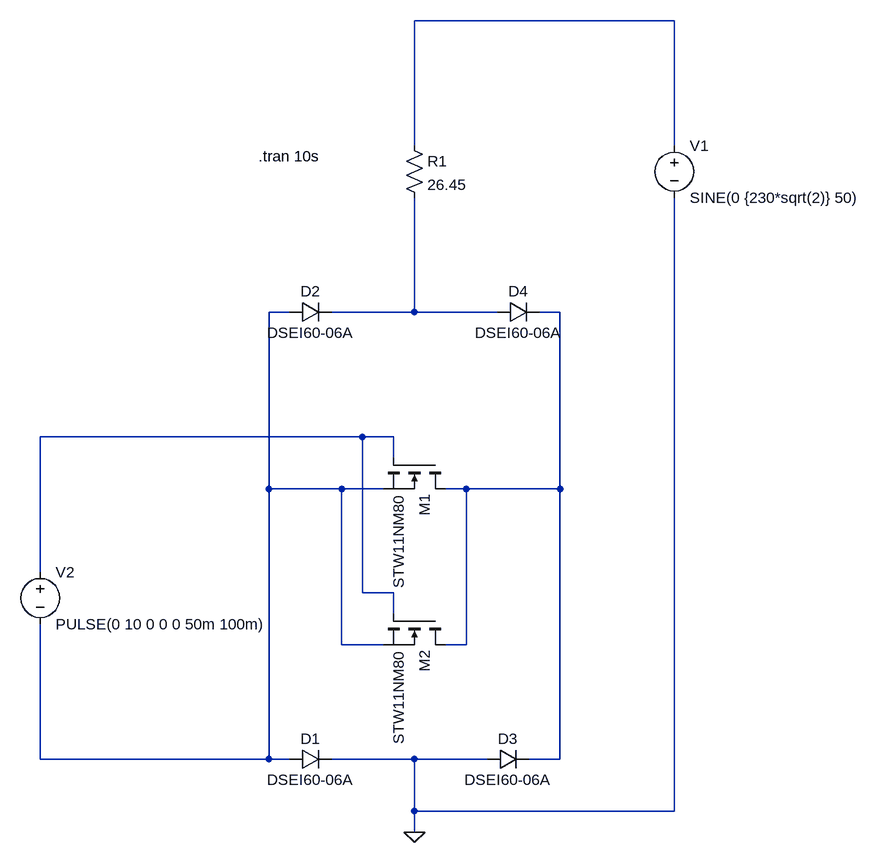
[diagram p0: schematic SSR.asc]
SSR.asc, the LTspice schematic file:
Version 4
SHEET 1 1012 880
WIRE 624 -496 224 -496
WIRE 224 -304 224 -496
WIRE 624 -304 624 -496
WIRE 32 -48 0 -48
WIRE 224 -48 224 -224
WIRE 224 -48 96 -48
WIRE 352 -48 224 -48
WIRE 448 -48 416 -48
WIRE 144 144 -352 144
WIRE 192 144 144 144
WIRE 192 176 192 144
WIRE 0 224 0 -48
WIRE 112 224 0 224
WIRE 176 224 112 224
WIRE 304 224 272 224
WIRE 448 224 448 -48
WIRE 448 224 304 224
WIRE -352 352 -352 144
WIRE 144 384 144 144
WIRE 192 384 144 384
WIRE 192 416 192 384
WIRE 112 464 112 224
WIRE 176 464 112 464
WIRE 304 464 304 224
WIRE 304 464 272 464
WIRE -352 640 -352 432
WIRE 0 640 0 224
WIRE 0 640 -352 640
WIRE 32 640 0 640
WIRE 224 640 96 640
WIRE 336 640 224 640
WIRE 448 640 448 224
WIRE 448 640 400 640
WIRE 224 720 224 640
WIRE 624 720 624 -224
WIRE 624 720 224 720
WIRE 224 752 224 720
FLAG 224 752 0
SYMBOL nmos 272 176 R90
SYMATTR InstName M1
SYMATTR Value STW11NM80
SYMBOL res 208 -320 R0
SYMATTR InstName R1
SYMATTR Value 26.45
SYMBOL nmos 272 416 R90
SYMATTR InstName M2
SYMATTR Value STW11NM80
SYMBOL diode 32 656 R270
WINDOW 0 32 32 VTop 2
WINDOW 3 0 32 VBottom 2
SYMATTR InstName D1
SYMATTR Value DSEI60-06A
SYMBOL diode 32 -32 R270
WINDOW 0 32 32 VTop 2
WINDOW 3 0 32 VBottom 2
SYMATTR InstName D2
SYMATTR Value DSEI60-06A
SYMBOL diode 336 656 R270
WINDOW 0 32 32 VTop 2
WINDOW 3 0 32 VBottom 2
SYMATTR InstName D3
SYMATTR Value DSEI60-06A
SYMBOL diode 352 -32 R270
WINDOW 0 32 32 VTop 2
WINDOW 3 0 32 VBottom 2
SYMATTR InstName D4
SYMATTR Value DSEI60-06A
SYMBOL voltage 624 -320 R0
SYMATTR InstName V1
SYMATTR Value SINE(0 {230*sqrt(2)} 50)
SYMBOL voltage -352 336 R0
SYMATTR InstName V2
SYMATTR Value PULSE(0 10 0 0 0 50m 100m)
TEXT -16 -288 Left 2 !.tran 10s

The netlist it stands for:
* SSR.asc
M1 N004 N005 N002 N002 STW11NM80
R1 N001 N003 26.45
M2 N004 N005 N002 N002 STW11NM80
D1 N002 0 DSEI60-06A
D2 N002 N003 DSEI60-06A
D3 0 N004 DSEI60-06A
D4 N003 N004 DSEI60-06A
V1 N001 0 SINE(0 {230*sqrt(2)} 50)
V2 N005 N002 PULSE(0 10 0 0 0 50m 100m)
.model D D
.lib standard.dio
.model NMOS NMOS
.model PMOS PMOS
.lib standard.mos
.tran 10s
.backanno
.end